# EAGLE design ReflowOven (EAGLE 5.12)
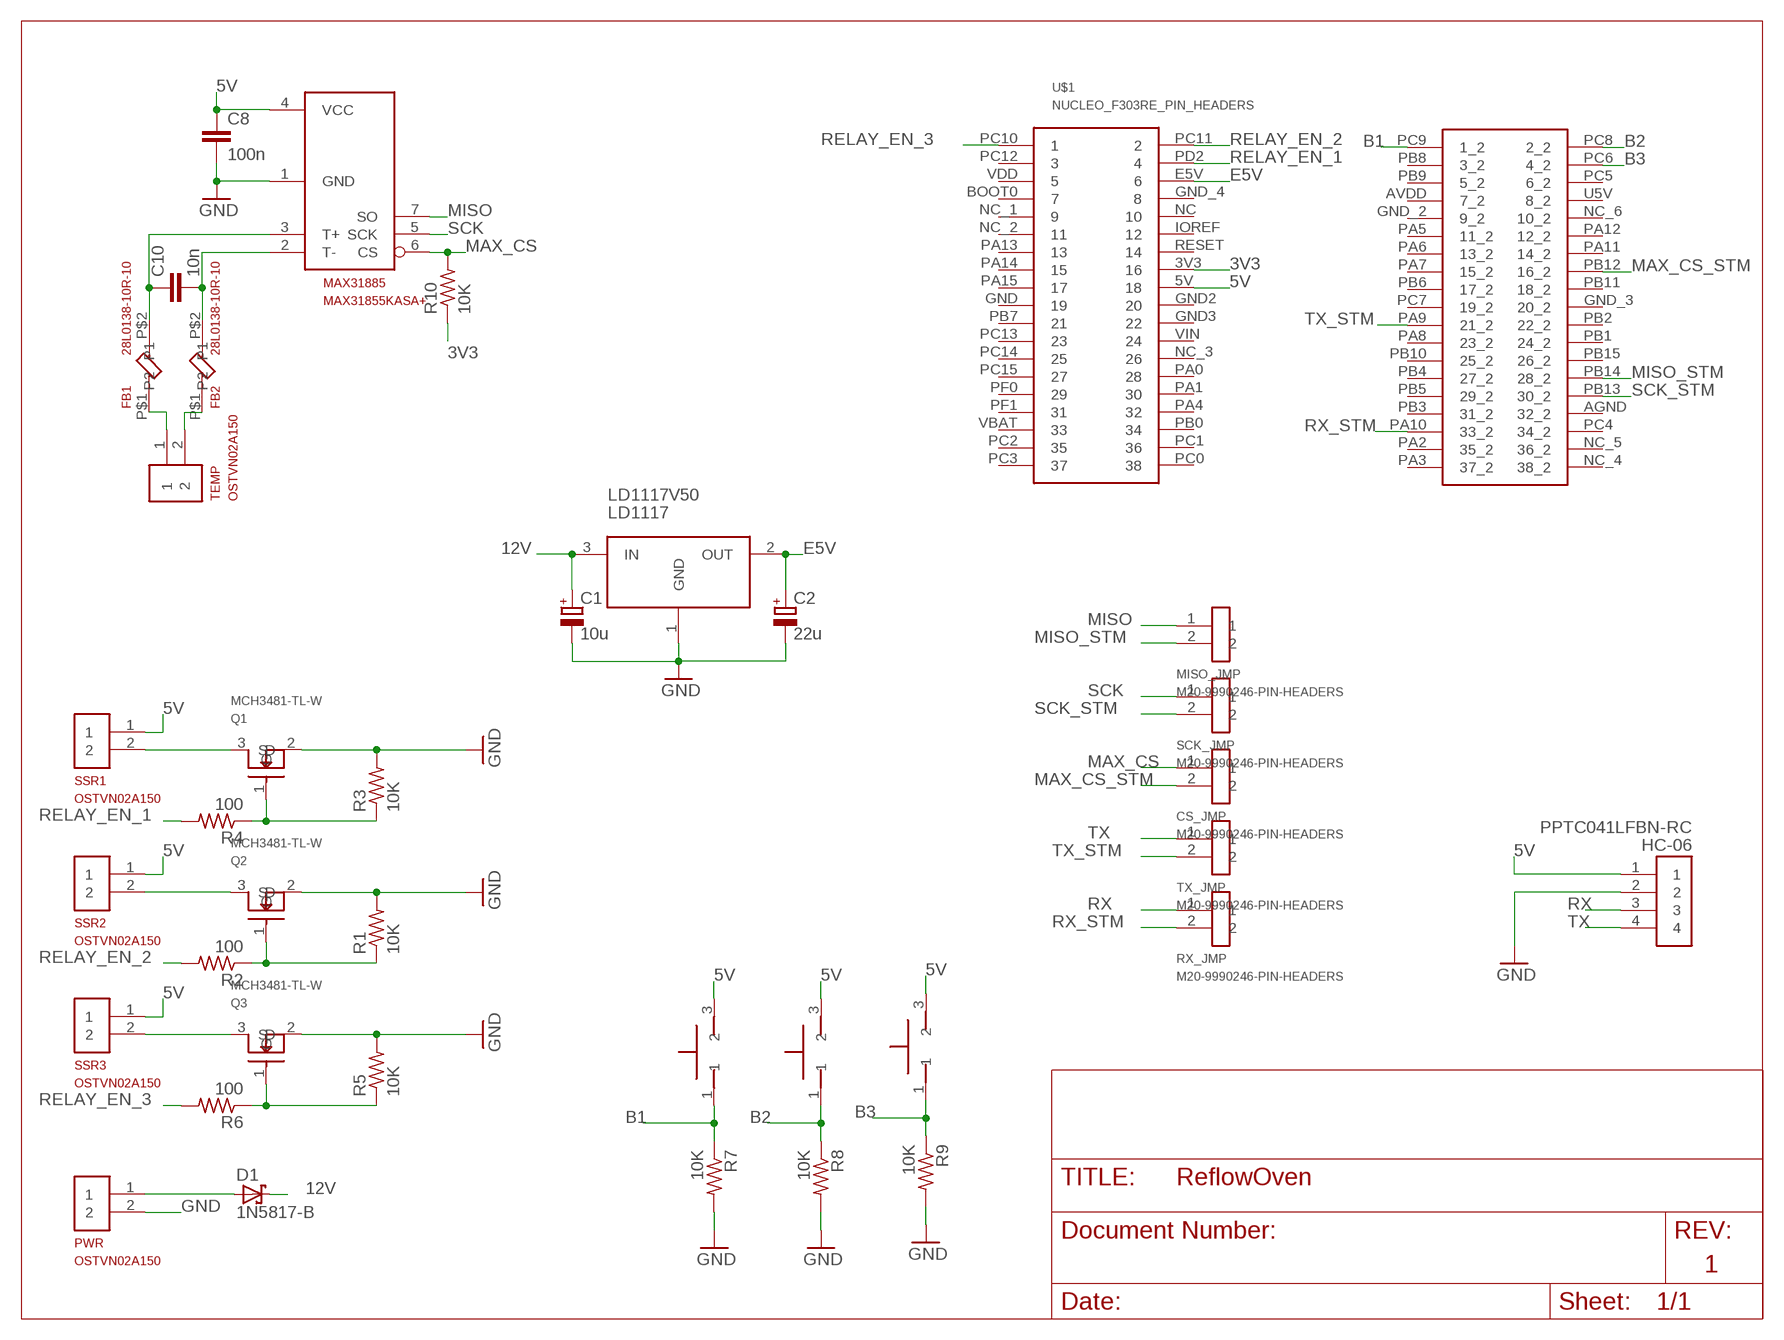
[diagram p0: schematic, sheet 1]

## Parts
C1  10u  CPOL-EUE2-5  [E2-5]
C2  22u  CPOL-EUE2-5  [E2-5]
C8  100n  C-EU025-024X044  [C025-024X044]
C10  10n  C-EU050-024X044  [C050-024X044]
CS_JMP  M20-9990246-PIN-HEADERS  [2-PIN-HEADER-MALE]
D1  1N5817-B  [DO41-7.6]
FB1  28L0138-10R-10  [AXIAL-0.3]
FB2  28L0138-10R-10  [AXIAL-0.3]
HC-06  PPTC041LFBN-RC  [4-PIN-HEADER-FEMALE]
LD1117V50  LD1117  [TO220DS]
MAX31885  MAX31855KASA+  [8-SOIC]
MISO_JMP  M20-9990246-PIN-HEADERS  [2-PIN-HEADER-MALE]
PWR  OSTVN02A150  [2-PIN-SCREW-TERMINAL]
Q1  MCH3481-TL-W  [SOT-23-3]
Q2  MCH3481-TL-W  [SOT-23-3]
Q3  MCH3481-TL-W  [SOT-23-3]
R1  10K  R-US_0204/5  [0204/5]
R2  100  R-US_0204/5  [0204/5]
R3  10K  R-US_0204/5  [0204/5]
R4  100  R-US_0204/5  [0204/5]
R5  10K  R-US_0204/5  [0204/5]
R6  100  R-US_0204/5  [0204/5]
R7  10K  R-US_0204/5  [0204/5]
R8  10K  R-US_0204/5  [0204/5]
R9  10K  R-US_0204/5  [0204/5]
R10  10K  R-US_0204/5  [0204/5]
RX_JMP  M20-9990246-PIN-HEADERS  [2-PIN-HEADER-MALE]
SCK_JMP  M20-9990246-PIN-HEADERS  [2-PIN-HEADER-MALE]
SSR1  OSTVN02A150  [2-PIN-SCREW-TERMINAL]
SSR2  OSTVN02A150  [2-PIN-SCREW-TERMINAL]
SSR3  OSTVN02A150  [2-PIN-SCREW-TERMINAL]
TEMP  OSTVN02A150  [2-PIN-SCREW-TERMINAL]
TX_JMP  M20-9990246-PIN-HEADERS  [2-PIN-HEADER-MALE]
U$1  NUCLEO_F303RE_PIN_HEADERS  [PPPC192LFBN-RC_2X]
U$2  TE-ALCOSWITCH-1825910-6  [4-PIN-SPST-SWITCH]
U$3  TE-ALCOSWITCH-1825910-6  [4-PIN-SPST-SWITCH]
U$4  TE-ALCOSWITCH-1825910-6  [4-PIN-SPST-SWITCH]

## Nets
3V3: R10.1 U$1.3V3
5V: C8.1 HC-06.1 MAX31885.4(VCC) SSR1.1 SSR2.1 SSR3.1 U$1.5V U$2.3 U$3.3 U$4.3
12V: C1.+ D1.C LD1117V50.3(IN)
B1: R7.1 U$1.PC9(1_2) U$2.1
B2: R8.1 U$1.PC8(2_2) U$3.1
B3: R9.1 U$1.PC6(4_2) U$4.1
E5V: C2.+ LD1117V50.2(OUT) U$1.E5V
GND: C1.- C2.- C8.2 HC-06.2 LD1117V50.1(GND) MAX31885.1(GND) PWR.2 Q1.2(S) Q2.2(S) Q3.2(S) R1.2 R3.2 R5.2 R7.2 R8.2 R9.2
MAX_CS: CS_JMP.1 MAX31885.6(CS) R10.2
MAX_CS_STM: CS_JMP.2 U$1.PB12(16_2)
MISO: MAX31885.7(SO) MISO_JMP.1
MISO_STM: MISO_JMP.2 U$1.PB14(28_2)
N$1: FB1.P$1(P1) TEMP.1
N$2: FB2.P$1(P1) TEMP.2
N$3: C10.2 FB2.P$2(P2) MAX31885.2(T-)
N$4: C10.1 FB1.P$2(P2) MAX31885.3(T+)
N$5: Q1.1(G) R3.1 R4.1
N$6: Q1.3(D) SSR1.2
N$7: Q2.1(G) R1.1 R2.1
N$8: Q3.1(G) R5.1 R6.1
N$9: Q3.3(D) SSR3.2
N$10: Q2.3(D) SSR2.2
N$11: D1.A PWR.1
RELAY_EN_1: R4.2 U$1.PD2
RELAY_EN_2: R2.2 U$1.PC11
RELAY_EN_3: R6.2 U$1.PC10
RX: HC-06.3 RX_JMP.1
RX_STM: RX_JMP.2 U$1.PA10(33_2)
SCK: MAX31885.5(SCK) SCK_JMP.1
SCK_STM: SCK_JMP.2 U$1.PB13(30_2)
TX: HC-06.4 TX_JMP.1
TX_STM: TX_JMP.2 U$1.PA9(21_2)
Unconnected: U$1.AGND(32_2) U$1.AVDD(7_2) U$1.BOOT0 U$1.GND U$1.GND2 U$1.GND3 U$1.GND_2(9_2) U$1.GND_3(20_2) U$1.GND_4 U$1.IOREF U$1.NC U$1.NC_1 U$1.NC_2 U$1.NC_3 U$1.NC_4(38_2) U$1.NC_5(36_2) U$1.NC_6(10_2) U$1.PA0 U$1.PA1 U$1.PA2(35_2) U$1.PA3(37_2) U$1.PA4 U$1.PA5(11_2) U$1.PA6(13_2) U$1.PA7(15_2) U$1.PA8(23_2) U$1.PA11(14_2) U$1.PA12(12_2) U$1.PA13 U$1.PA14 U$1.PA15 U$1.PB0 U$1.PB1(24_2) U$1.PB2(22_2) U$1.PB3(31_2) U$1.PB4(27_2) U$1.PB5(29_2) U$1.PB6(17_2) U$1.PB7 U$1.PB8(3_2) U$1.PB9(5_2) U$1.PB10(25_2) U$1.PB11(18_2) U$1.PB15(26_2) U$1.PC0 U$1.PC1 U$1.PC2 U$1.PC3 U$1.PC4(34_2) U$1.PC5(6_2) U$1.PC7(19_2) U$1.PC12 U$1.PC13 U$1.PC14 U$1.PC15 U$1.PF0 U$1.PF1 U$1.RESET U$1.U5V(8_2) U$1.VBAT U$1.VDD U$1.VIN

## Notes on the sheet
- 1

## Library data of the parts
C1 C2 = rcl:CPOL-EU: POLARIZED CAPACITOR, European symbol
C8 C10 = rcl:C-EU: CAPACITOR, European symbol
CS_JMP MISO_JMP RX_JMP SCK_JMP TX_JMP = Reflow_Oven:M20-9990246-PIN-HEADERS
D1 = diode:1N581*: 1.0A SCHOTTKY BARRIER RECTIFIER Source: http://www.diodes.com/datasheets/ds23001.pdf
FB1 FB2 = Reflow_Oven:28L0138-10R-10
HC-06 = Reflow_Oven:PPTC041LFBN-RC
LD1117V50 = Reflow_Oven:LD1117
MAX31885 = Reflow_Oven:MAX31855KASA+
PWR SSR1-SSR3 TEMP = Reflow_Oven:OSTVN02A150
Q1-Q3 = Reflow_Oven:MCH3481-TL-W
R1-R10 = rcl:R-US_: RESISTOR, American symbol
U$1 = Reflow_Oven:NUCLEO_F303RE_PIN_HEADERS
U$2-U$4 = Reflow_Oven:TE-ALCOSWITCH-1825910-6

## Board
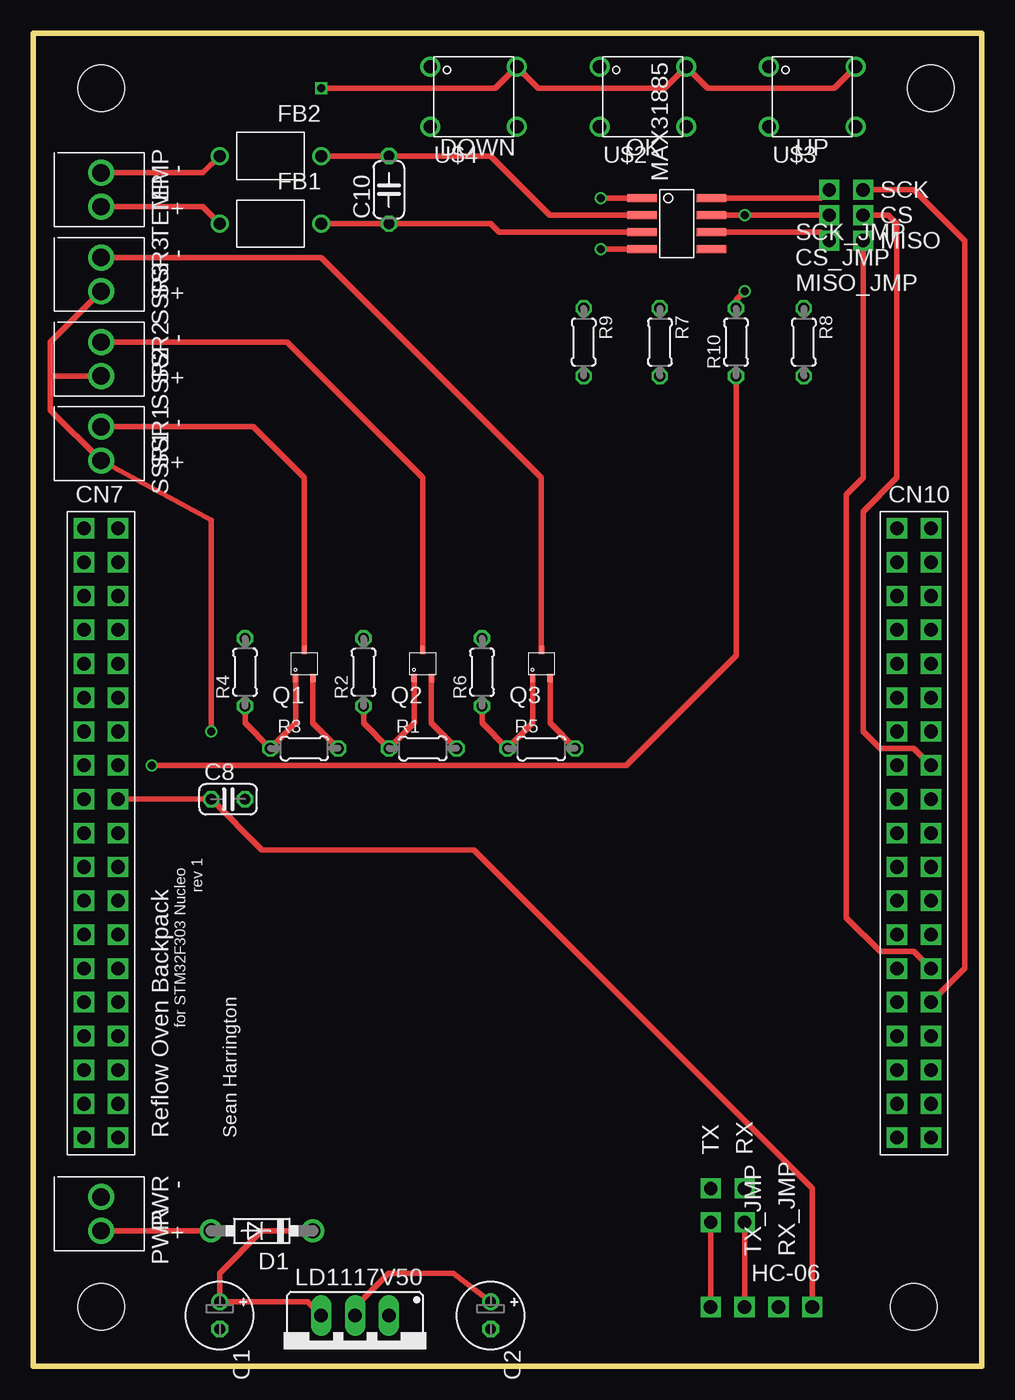
[diagram p1: board, top side]
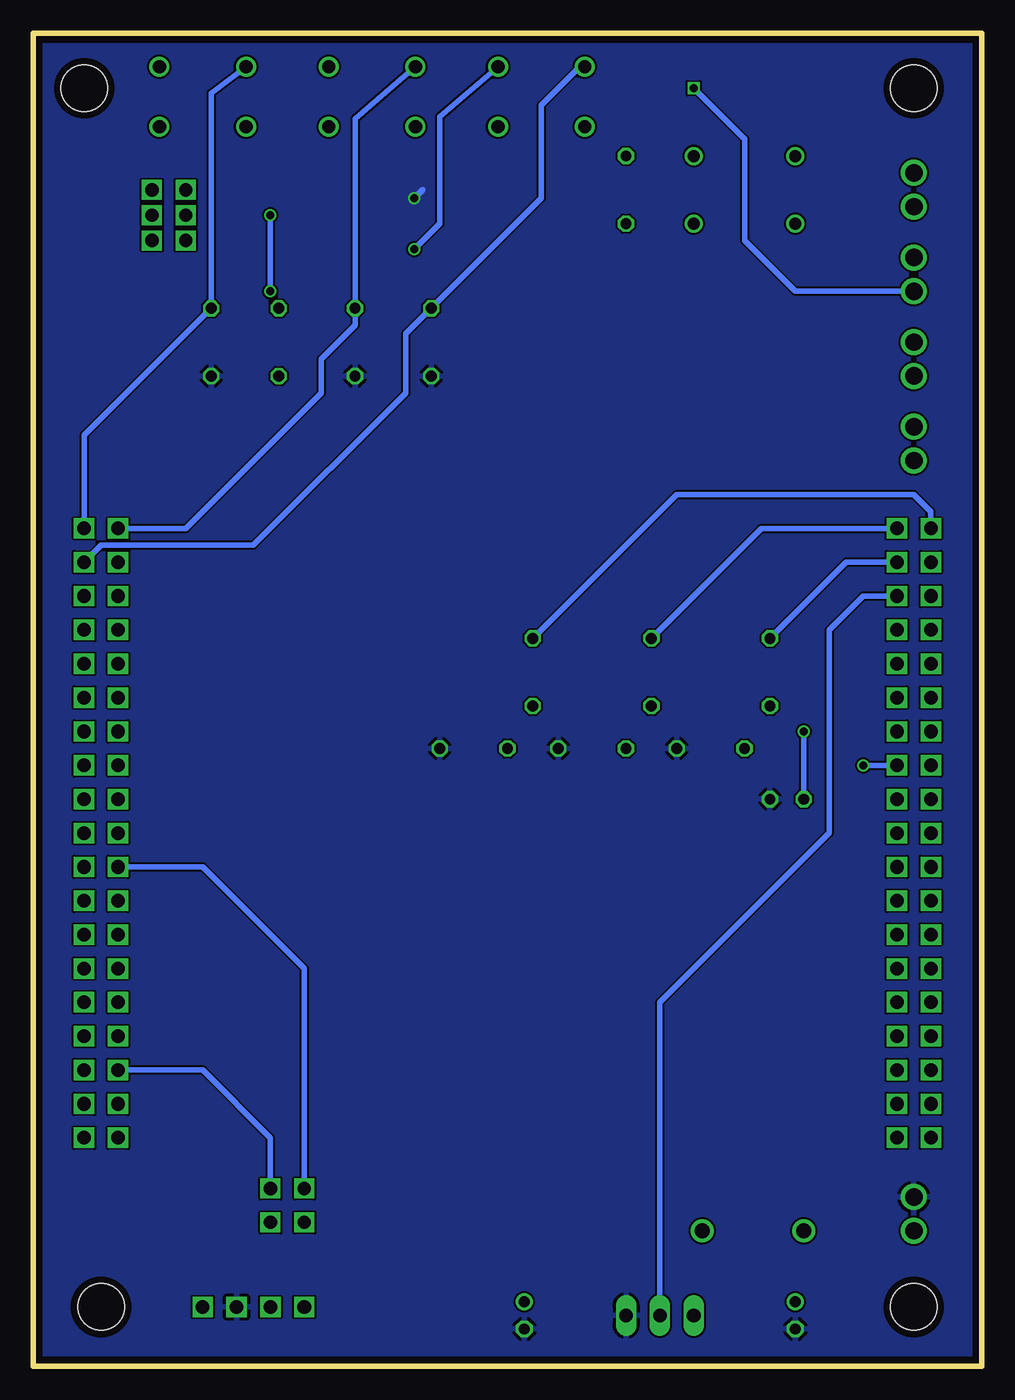
[diagram p2: board, bottom side, seen from below]

Size 71.12 x 100 mm. Coordinates in mm from the lower left corner, seen from the top.
Outline: 0,100 0,0 71.12,0 71.12,100 0,100
Copper layers (1*16): Top 0.035mm / dielectric 1.6mm / Bottom 0.035mm
Design rules "Elecrow_2-layer_PCB_eagle_rule": minimum track width 6mil, minimum drill 12mil, track to track 6mil, track to pad 6mil, pad to pad 6mil, via to via 8mil, smd to smd 0mil, copper to edge 20mil, drill to drill 10mil, minimum pad ring 6mil, minimum via ring 6mil, stop-mask expansion 0mil, vias tented up to drill 100mil, thermal gap 10mil
Holes 3.5 mm at 5.08,95.88 67.31,95.88 66.04,4.44 5.08,4.44
tKeepout: area -0.7,9.5 to 69.3,92

### Footprints (pad centres in the part's own frame; a part is rotated, then mirrored left to right if it is on the bottom)
E2-5 = drill 0.813 pad 1.27 round: + -1.016,0 | drill 0.813 pad 1.27 octagon: - 1.016,0
C025-024X044 = drill 0.813 octagon: 1 -1.27,0; 2 1.27,0
C050-024X044 = drill 0.813 octagon: 1 -2.54,0; 2 2.54,0
2-PIN-HEADER-MALE = drill 1 square: 1 -1.27,0; 2 1.27,0
DO41-7.6 = drill 1.1 pad 1.7 round: A 3.81,0; C -3.81,0
AXIAL-0.3 = drill 0.9 round: P$1 0,3.81; P$2 0,-3.81
4-PIN-HEADER-FEMALE = drill 1.016 square: 1 -3.81,0; 2 -1.27,0; 3 1.27,0; 4 3.81,0
TO220DS = drill 1.016 long: 1 -2.54,-2.54; 2 0,-2.54; 3 2.54,-2.54
8-SOIC = smd 0.6 x 2.2: 1 1.905,2.6; 2 0.635,2.6; 3 -0.635,2.6; 4 -1.905,2.6; 5 1.905,-2.6; 6 0.635,-2.6; 7 -0.635,-2.6; 8 -1.905,-2.6
2-PIN-SCREW-TERMINAL = drill 1.3 round: 1 -1.27,0; 2 1.27,0
SOT-23-3 = smd 0.4 x 0.6: 1 -0.65,-1.05; 2 0.65,-1.05; 3 0,1.05
0204/5 = drill 0.813 octagon: 1 -2.54,0; 2 2.54,0
PPPC192LFBN-RC_2X = drill 1.02 square: 3V3 -29.21,5.08; 5V -29.21,2.54; AGND 31.75,-15.24; AVDD 29.21,15.24; BOOT0 -31.75,15.24; E5V -29.21,17.78; GND -31.75,0; GND2 -29.21,-2.54; GND3 -29.21,0; GND_2 31.75,0; GND_3 29.21,12.7; GND_4 -29.21,15.24; IOREF -29.21,10.16; NC -29.21,-7.62; NC_1 -31.75,12.7; NC_2 -31.75,10.16; NC_3 -29.21,12.7; NC_4 31.75,-22.86; NC_5 31.75,-20.32; NC_6 31.75,12.7; PA0 -29.21,-10.16; PA1 -29.21,-12.7; PA2 29.21,-20.32; PA3 29.21,-22.86; PA4 -29.21,-15.24; PA5 29.21,10.16; PA6 29.21,7.62; PA7 29.21,5.08; PA8 29.21,-5.08; PA9 29.21,-2.54; PA10 29.21,-17.78; PA11 31.75,7.62; PA12 31.75,10.16; PA13 -31.75,7.62; PA14 -31.75,5.08; PA15 -31.75,2.54; PB0 -29.21,-17.78; PB1 31.75,-5.08; PB2 31.75,-2.54; PB3 29.21,-15.24; PB4 29.21,-10.16; PB5 29.21,-12.7; PB6 29.21,2.54; PB7 -31.75,-2.54; PB8 29.21,20.32; PB9 29.21,17.78; PB10 29.21,-7.62; PB11 31.75,2.54; PB12 31.75,5.08; PB13 31.75,-12.7; PB14 31.75,-10.16; PB15 31.75,-7.62; PC0 -29.21,-22.86; PC1 -29.21,-20.32; PC2 -31.75,-20.32; PC3 -31.75,-22.86; PC4 31.75,-17.78; PC5 31.75,17.78; PC6 31.75,20.32; PC7 29.21,0; PC8 31.75,22.86; PC9 29.21,22.86; PC10 -31.75,22.86; PC11 -29.21,22.86; PC12 -31.75,20.32; PC13 -31.75,-5.08; PC14 -31.75,-7.62; PC15 -31.75,-10.16; PD2 -29.21,20.32; PF0 -31.75,-12.7; PF1 -31.75,-15.24; RESET -29.21,7.62; U5V 31.75,15.24; VBAT -31.75,-17.78; VDD -31.75,17.78; VIN -29.21,-5.08
4-PIN-SPST-SWITCH = drill 1 round: 1 -3.25,2.25; 2 -3.25,-2.25; 3 3.25,2.25; 4 3.25,-2.25

### Placement (x,y rotation side)
C1  13.97,3.8 270 top
C2  34.29,3.8 270 top
C8  14.61,42.54 0 top
C10  26.67,88.26 90 top
CS_JMP  60.96,86.35 0 top
D1  17.15,10.16 180 top
FB1  17.78,85.72 90 top
FB2  17.78,90.8 90 top
HC-06  54.61,4.44 180 top
LD1117V50  24.13,1.27 180 top
MAX31885  48.26,85.72 90 top
MISO_JMP  60.96,84.45 0 top
PWR  5.08,11.43 90 top
Q1  20.32,52.7 0 top
Q2  29.21,52.7 0 top
Q3  38.1,52.7 0 top
R1  29.21,46.35 0 top
R2  24.77,52.06 90 top
R3  20.32,46.35 0 top
R4  15.88,52.06 90 top
R5  38.1,46.35 0 top
R6  33.66,52.06 90 top
R7  46.99,76.83 270 top
R8  57.79,76.83 270 top
R9  41.28,76.83 270 top
R10  52.7,76.83 90 top
RX_JMP  53.34,12.06 90 top
SCK_JMP  60.96,88.26 0 top
SSR1  5.08,69.21 90 top
SSR2  5.08,75.56 90 top
SSR3  5.08,81.91 90 top
TEMP  5.08,88.26 90 top
TX_JMP  50.8,12.06 90 top
U$1  35.56,40 0 top
U$2  45.72,95.25 0 top
U$3  58.42,95.25 0 top
U$4  33.02,95.25 0 top

### Tracks (layer width: path | path; a pad name or v marks a point on that pad's centre or on a via)
3V3  (via drill 0.6)
  Top 0.406: R10.1 52.7,53.34 44.45,45.08 v8.89,45.08
  Bottom 0.406: v8.89,45.08 U$1.3V3
5V  (via drill 0.6)
  Top 0.406: U$1.5V C8.1 17.15,38.73 33.02,38.73 58.42,13.33 HC-06.1 | SSR3.1 1.27,76.83 1.27,74.29 | 1.27,74.29 1.27,71.75 SSR1.1 13.34,63.5 v13.34,47.62 | 1.27,74.29 SSR2.1 | v42.55,83.81 MAX31885.4 | v21.59,95.88 34.66,95.88 U$4.3 37.89,95.88 47.36,95.88 U$2.3 50.59,95.88 60.06,95.88 U$3.3
  Bottom 0.406: v42.55,83.81 40.64,85.72 40.64,93.76 U$4.3 | v13.34,47.62 C8.1 | SSR3.1 13.97,80.64 17.78,84.45 17.78,92.07 v21.59,95.88
12V
  Top 0.406: LD1117V50.3 20.57,4.82 C1.+ 13.97,6.98 17.15,10.16 D1.C
B1
  Bottom 0.406: U$1.PC9 59.69,62.86 49.53,73.02 49.53,75.56 46.99,78.1 R7.1 46.99,93.61 U$2.1
B2
  Bottom 0.406: U$1.PC8 67.31,69.84 R8.1 57.79,95.52 U$3.1
B3
  Bottom 0.406: U$1.PC6 66.04,61.59 54.61,61.59 43.18,73.02 43.18,77.47 R9.1 33.02,87.62 33.02,94.61 29.77,97.86 U$4.1
E5V
  Top 0.406: C2.+ 31.5,6.98 26.67,6.98 24.13,4.44 LD1117V50.2
  Bottom 0.406: LD1117V50.2 24.13,27.3 11.43,40 11.43,55.24 8.89,57.78 U$1.E5V
GND  (via drill 0.6)
  Top 0.406: R3.2 20.97,48.24 Q1.2 | R1.2 29.86,48.24 Q2.2 | R5.2 38.75,48.24 Q3.2 | v42.55,87.62 MAX31885.1
  Bottom 0.406: v42.55,87.62 41.91,88.26
  pour Bottom: -20.32,112.39 -20.32,-15.88 13.97,-15.88 88.9,-15.88 88.9,112.39
MAX_CS  (via drill 0.6)
  Top 0.406: CS_JMP.1 v53.34,86.35 MAX31885.6 | R10.2 52.7,80 v53.34,80.64
  Bottom 0.406: v53.34,80.64 v53.34,86.35
MAX_CS_STM
  Top 0.406: CS_JMP.2 64.14,86.35 64.77,85.72 64.77,66.67 62.23,64.13 62.23,47.62 63.5,46.35 66.04,46.35 U$1.PB12
MISO
  Top 0.406: MAX31885.7 59.06,85.09 MISO_JMP.1
MISO_STM
  Top 0.406: MISO_JMP.2 62.23,66.67 60.96,65.4 60.96,33.65 63.5,31.11 66.04,31.11 U$1.PB14
N$1
  Top 0.406: TEMP.1 12.7,86.99 FB1.P$1
N$2
  Top 0.406: TEMP.2 12.7,89.53 FB2.P$1
N$3
  Top 0.406: FB2.P$2 C10.2 34.29,90.8 38.73,86.35 MAX31885.2
N$4
  Top 0.406: FB1.P$2 C10.1 34.29,85.72 34.93,85.09 MAX31885.3
N$5
  Top 0.406: Q1.1 19.67,48.24 R3.1 15.88,48.26 R4.1
N$6
  Top 0.406: SSR1.2 16.51,70.48 20.32,66.67 Q1.3
N$7
  Top 0.406: Q2.1 28.56,48.24 R1.1 24.77,48.26 R2.1
N$8
  Top 0.406: Q3.1 37.45,48.24 R5.1 33.66,48.26 R6.1
N$9
  Top 0.406: SSR3.2 21.59,83.18 38.1,66.67 Q3.3
N$10
  Top 0.406: SSR2.2 19.05,76.83 29.21,66.67 Q2.3
N$11
  Top 0.406: D1.A PWR.1
RELAY_EN_1
  Bottom 0.406: U$1.PD2 10.16,60.32 R4.2
RELAY_EN_2
  Bottom 0.406: R2.2 16.51,62.86 U$1.PC11
RELAY_EN_3
  Bottom 0.406: R6.2 22.86,65.4 5.08,65.4 3.81,64.13 U$1.PC10
RX
  Top 0.406: RX_JMP.1 HC-06.3
RX_STM
  Bottom 0.406: RX_JMP.2 53.34,17.14 58.42,22.22 U$1.PA10
SCK
  Top 0.406: MAX31885.5 59.06,87.62 SCK_JMP.1
SCK_STM
  Top 0.406: SCK_JMP.2 66.04,88.26 69.85,84.45 69.85,29.84 U$1.PB13
TX
  Top 0.406: TX_JMP.1 HC-06.4
TX_STM
  Bottom 0.406: TX_JMP.2 50.8,29.84 58.42,37.46 U$1.PA9

### Text on the board
tPlace: DOWN | OK | UP | - | SCK | TEMP | + | CS | MISO | - | SSR3 | + | - | SSR2 | + | - | SSR1 | + | CN7 | CN10 | rev 1 | for STM32F303 Nucleo | Reflow Oven Backpack | Sean Harrington | TX | RX | - | PWR | +